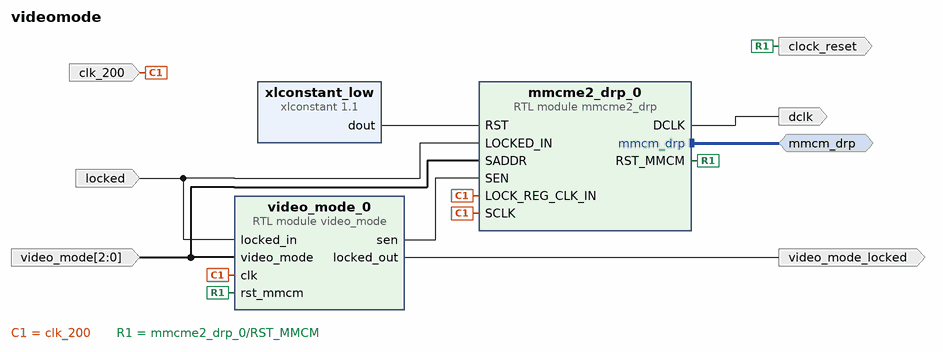
[diagram p0: block diagram of the top level]
# Vivado block design videomode, xc7a100tcsg324-1, Vivado 2021.2.1
create_bd_design videomode

create_bd_intf_port -mode Master -vlnv xilinx.com:interface:drp_rtl:1.0 mmcm_drp
create_bd_port -dir I -from 2 -to 0 video_mode
create_bd_port -dir O -type rst clock_reset
create_bd_port -dir O dclk
create_bd_port -dir I locked
create_bd_port -dir I -type clk clk_200
set_property -dict {CONFIG.CLK_DOMAIN videomode_sys_clk CONFIG.FREQ_HZ 200000000} [get_bd_ports clk_200]
create_bd_port -dir O video_mode_locked

create_bd_cell -type ip -vlnv xilinx.com:ip:xlconstant:1.1 xlconstant_low
set_property -dict {CONFIG.CONST_VAL 0} [get_bd_cells xlconstant_low]
create_bd_cell -type module -reference mmcme2_drp mmcme2_drp_0
set_property -dict [list \
  CONFIG.S1_BANDWIDTH OPTIMIZED \
  CONFIG.S1_CLKFBOUT_FRAC 0 \
  CONFIG.S1_CLKFBOUT_MULT 42 \
  CONFIG.S1_CLKOUT0_DIVIDE 6 \
  CONFIG.S1_CLKOUT0_FRAC 0 \
  CONFIG.S1_CLKOUT1_DIVIDE 30 \
  CONFIG.S1_CLKOUT2_DIVIDE 60 \
  CONFIG.S1_CLKOUT3_DIVIDE 120 \
  CONFIG.S1_CLKOUT4_DIVIDE 1 \
  CONFIG.S1_CLKOUT5_DIVIDE 1 \
  CONFIG.S1_DIVCLK_DIVIDE 5 \
  CONFIG.S2_BANDWIDTH OPTIMIZED \
  CONFIG.S2_CLKFBOUT_FRAC 0 \
  CONFIG.S2_CLKFBOUT_MULT 50 \
  CONFIG.S2_CLKOUT0_DIVIDE 5 \
  CONFIG.S2_CLKOUT0_FRAC 0 \
  CONFIG.S2_CLKOUT1_DIVIDE 25 \
  CONFIG.S2_CLKOUT2_DIVIDE 50 \
  CONFIG.S2_CLKOUT3_DIVIDE 100 \
  CONFIG.S2_CLKOUT4_DIVIDE 1 \
  CONFIG.S2_CLKOUT5_DIVIDE 1 \
  CONFIG.S2_CLKOUT6_DIVIDE 1 \
  CONFIG.S2_CLKOUT6_PHASE 0 \
  CONFIG.S2_DIVCLK_DIVIDE 7 \
  CONFIG.S3_BANDWIDTH OPTIMIZED \
  CONFIG.S3_CLKFBOUT_FRAC 875 \
  CONFIG.S3_CLKFBOUT_MULT 61 \
  CONFIG.S3_CLKOUT0_DIVIDE 6 \
  CONFIG.S3_CLKOUT0_FRAC 0 \
  CONFIG.S3_CLKOUT1_DIVIDE 30 \
  CONFIG.S3_CLKOUT2_DIVIDE 60 \
  CONFIG.S3_CLKOUT3_DIVIDE 120 \
  CONFIG.S3_DIVCLK_DIVIDE 7 \
  CONFIG.S4_BANDWIDTH OPTIMIZED \
  CONFIG.S4_CLKFBOUT_FRAC 0 \
  CONFIG.S4_CLKFBOUT_MULT 9 \
  CONFIG.S4_CLKOUT0_DIVIDE 6 \
  CONFIG.S4_CLKOUT0_FRAC 0 \
  CONFIG.S4_CLKOUT1_DIVIDE 30 \
  CONFIG.S4_CLKOUT2_DIVIDE 60 \
  CONFIG.S4_CLKOUT3_DIVIDE 120 \
  CONFIG.S4_CLKOUT4_DIVIDE 1 \
  CONFIG.S4_CLKOUT5_DIVIDE 1 \
  CONFIG.S4_CLKOUT6_DIVIDE 1 \
  CONFIG.S4_CLKOUT6_PHASE 0 \
  CONFIG.S4_DIVCLK_DIVIDE 1 \
  CONFIG.S5_BANDWIDTH OPTIMIZED \
  CONFIG.S5_CLKFBOUT_FRAC 500 \
  CONFIG.S5_CLKFBOUT_MULT 46 \
  CONFIG.S5_CLKOUT0_DIVIDE 6 \
  CONFIG.S5_CLKOUT0_FRAC 0 \
  CONFIG.S5_CLKOUT1_DIVIDE 30 \
  CONFIG.S5_CLKOUT2_DIVIDE 60 \
  CONFIG.S5_CLKOUT3_DIVIDE 120 \
  CONFIG.S5_DIVCLK_DIVIDE 5 \
  CONFIG.S6_BANDWIDTH OPTIMIZED \
  CONFIG.S6_CLKFBOUT_FRAC 0 \
  CONFIG.S6_CLKFBOUT_MULT 48 \
  CONFIG.S6_CLKOUT0_DIVIDE 6 \
  CONFIG.S6_CLKOUT0_FRAC 0 \
  CONFIG.S6_CLKOUT1_DIVIDE 30 \
  CONFIG.S6_CLKOUT2_DIVIDE 60 \
  CONFIG.S6_CLKOUT3_DIVIDE 120 \
  CONFIG.S6_CLKOUT4_DIVIDE 1 \
  CONFIG.S6_CLKOUT5_DIVIDE 1 \
  CONFIG.S6_CLKOUT6_DIVIDE 1 \
  CONFIG.S6_CLKOUT6_PHASE 0 \
  CONFIG.S6_DIVCLK_DIVIDE 5 \
  CONFIG.S7_BANDWIDTH OPTIMIZED \
  CONFIG.S7_CLKFBOUT_FRAC 500 \
  CONFIG.S7_CLKFBOUT_MULT 49 \
  CONFIG.S7_CLKOUT0_DIVIDE 6 \
  CONFIG.S7_CLKOUT0_FRAC 0 \
  CONFIG.S7_CLKOUT1_DIVIDE 30 \
  CONFIG.S7_CLKOUT2_DIVIDE 60 \
  CONFIG.S7_CLKOUT3_DIVIDE 120 \
  CONFIG.S7_DIVCLK_DIVIDE 5 \
  CONFIG.S8_BANDWIDTH OPTIMIZED \
  CONFIG.S8_CLKFBOUT_FRAC 500 \
  CONFIG.S8_CLKFBOUT_MULT 40 \
  CONFIG.S8_CLKOUT0_DIVIDE 6 \
  CONFIG.S8_CLKOUT0_FRAC 0 \
  CONFIG.S8_CLKOUT1_DIVIDE 30 \
  CONFIG.S8_CLKOUT2_DIVIDE 60 \
  CONFIG.S8_CLKOUT3_DIVIDE 120 \
  CONFIG.S8_CLKOUT4_DIVIDE 1 \
  CONFIG.S8_CLKOUT5_DIVIDE 1 \
  CONFIG.S8_CLKOUT6_DIVIDE 1 \
  CONFIG.S8_CLKOUT6_PHASE 0 \
  CONFIG.S8_DIVCLK_DIVIDE 5 \
] [get_bd_cells mmcme2_drp_0]
create_bd_cell -type module -reference video_mode video_mode_0

# ---- connections ----

connect_bd_intf_net [get_bd_intf_ports mmcm_drp] [get_bd_intf_pins mmcme2_drp_0/mmcm_drp]
connect_bd_net -net clk_200_1 [get_bd_ports clk_200] \
  [get_bd_pins mmcme2_drp_0/SCLK] [get_bd_pins mmcme2_drp_0/LOCK_REG_CLK_IN] [get_bd_pins video_mode_0/clk]
connect_bd_net [get_bd_ports locked] [get_bd_pins mmcme2_drp_0/LOCKED_IN] [get_bd_pins video_mode_0/locked_in]
connect_bd_net [get_bd_pins mmcme2_drp_0/DCLK] [get_bd_ports dclk]
connect_bd_net [get_bd_pins mmcme2_drp_0/RST_MMCM] [get_bd_ports clock_reset] [get_bd_pins video_mode_0/rst_mmcm]
connect_bd_net -net video_mode_0_locked [get_bd_pins video_mode_0/locked_out] [get_bd_ports video_mode_locked]
connect_bd_net [get_bd_pins video_mode_0/sen] [get_bd_pins mmcme2_drp_0/SEN]
connect_bd_net [get_bd_ports video_mode] [get_bd_pins mmcme2_drp_0/SADDR] [get_bd_pins video_mode_0/video_mode]
connect_bd_net [get_bd_pins xlconstant_low/dout] [get_bd_pins mmcme2_drp_0/RST]

validate_bd_design
save_bd_design
